# Altium schematic sheet Peripherals.SchDoc
size A
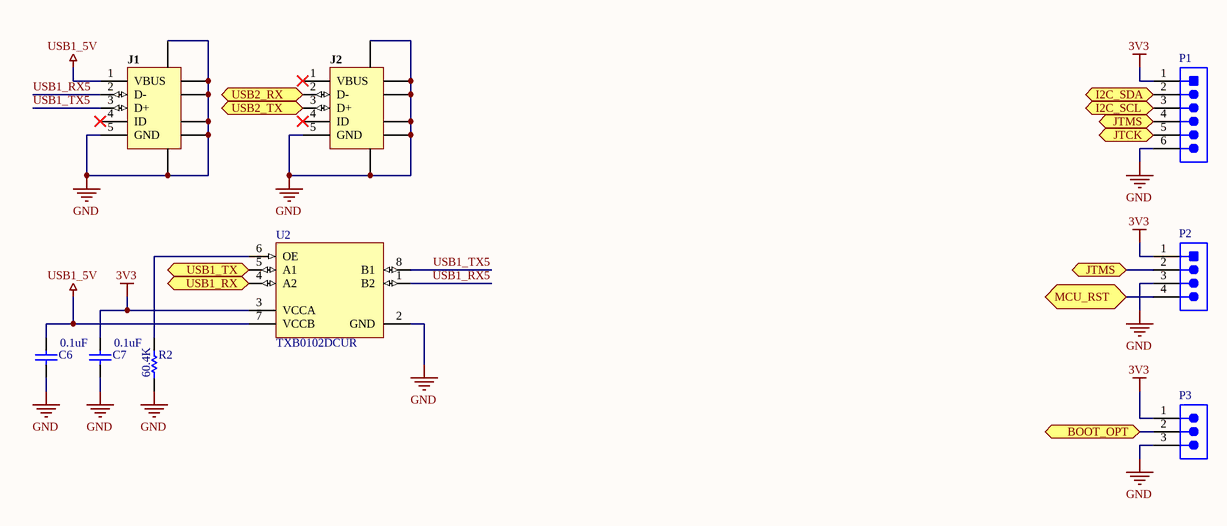
[diagram p0: Peripherals.SchDoc]

## Parts
C6  value 0.1uF  [CAPC3216X100X50LL20T25]  (hidden comment: C1206F104K3RACTU)
C7  value 0.1uF  [CAPC3216X100X50LL20T25]  (hidden comment: C1206F104K3RACTU)
J1  ZX62R-B-5P  [HIRO-ZX62R-B-5P_V]  (value not drawn)
J2  ZX62R-B-5P  [HIRO-ZX62R-B-5P_V]  (value not drawn)
P1  22-23-2061  [MOLX-22-23-2061_V]  (value not drawn)
P2  22-23-2041  [22-23-2041]  (value not drawn)
P3  PTT-103-01-L-S  [SMTC-PTT-103-01-X-S]  (value not drawn)
R2  value 60.4K  [RESC1206(3216)_M]  (hidden comment: 60K4 1% 1206(3216))
U2  TXB0102DCUR  [DCU0008A_N]

## Ports
BOOT_OPT (bidir), I2C_SCL (bidir), I2C_SDA (bidir), JTCK (bidir), JTMS (bidir), MCU_RST (bidir), USB1_RX (bidir), USB1_TX (bidir), USB2_RX (bidir), USB2_TX (bidir)

## Nets
3V3: C7.1 P1.1 P2.1 P3.1 U2.3(VCCA)
GND: C6.2 C7.2 J1.5(GND) J1.6(SHLD) J1.7(SHLD) J1.8(SHLD) J1.9(SHLD) J1.10(SHLD) J1.11(SHLD) J2.5(GND) J2.6(SHLD) J2.7(SHLD) J2.8(SHLD) J2.9(SHLD) J2.10(SHLD) J2.11(SHLD) P1.6 P2.3 P3.3 R2.1 U2.2(GND)
USB1_5V: C6.1 J1.1(VBUS) U2.7(VCCB)
BOOT_OPT: P3.2 ; port BOOT_OPT
I2C_SCL: P1.3 ; port I2C_SCL
I2C_SDA: P1.2 ; port I2C_SDA
JTCK: P1.5 ; port JTCK
JTMS: P1.4 P2.2 ; port JTMS
MCU_RST: P2.4 ; port MCU_RST
USB1_RX: U2.4(A2) ; port USB1_RX
USB1_RX5: J1.2(D-) U2.1(B2)
USB1_TX: U2.5(A1) ; port USB1_TX
USB1_TX5: J1.3(D+) U2.8(B1)
USB2_RX: J2.2(D-) ; port USB2_RX
USB2_TX: J2.3(D+) ; port USB2_TX
NetR2_2: R2.2 U2.6(OE)

Not connected (* = marked no-connect by the designer): J1 4(ID)*; J2 1(VBUS)* 4(ID)*

## Library data of the parts
C6 C7 = CMP-1664-00001-1: CAP CER 0.1UF 25V 10% X7R 1206; PackageReference: 1206; PartNumber: C1206F104K3RACTU; ComponentLink1URL: http://www.kemet.com/docfinder?Partnumber=C1206F104K3RACTU; ComponentLink1Description: Datasheet
J1 J2 = CMP-0031-00001-1: Connector; USBMicro-B,Reverse type, SMT; 5 Position; Right Angle; DatasheetVersion: 08/2010; Operating Temperature: -30 to 85 degC; Mounting Technology: Surface Mount; PartNumber: ZX62R-B-5P; PackageReference: ZX62R-B-5P; ComponentLink2URL: http://www.hirose.co.jp/cataloge_hp/e24200011.pdf; ComponentLink1URL: http://www.hirose.com/â€Ž; ComponentLink2Description: Datasheet; PackageDescription: 5-Pin USB Micro-B R/A Connector; ComponentLink1Description: Manufacturer URL
P1 = CMP-2000-05536-1: Male Header, Pitch 2.54 mm, 1 x 6 Position, Height 10.67 mm, Tail Length 3.56 mm, 0 to 70 degC, RoHS, Bulk; Manufacturer: Molex; Pitch: 2.54mm; Mounting Angle: Vertical; Current Rating: 4A; Number of Positions / Contacts: 6; Voltage Rating: 250V; Packaging: Bulk; Package Description: Male Header, Pitch 2.54 mm, 1 x 6 Position, Height 10.67 mm, Tail Length 3.56 mm; Number of Rows: 1; Type: PinStrip; Contact Material: Brass; Product Category: .100K.K.Connectors; Factory Pack Quantity: 1000; Mounting Style: ThroughHole; RoHS: Details; Contact Plating: Tin; Housing Material: Nylon; Mounting Technology: ThroughHole; Termination Style: ThroughHole; Tradename: KK; Number of Positions: 6; Brand: Molex; Product Type: Headers; Series: 6373; Datasheet URL: https://datasheet.ciiva.com/19460/232303-19460895.pdf; Package Reference: 22-23-2061; Datasheet Version: Rev. P, 09/2001; Manufacturer URL: http://www.molex.com/
P2 = 22-23-2041: MOLEX 4POS MALE HEADER VERT
P3 = CMP-1029-00143-1: Press Fit Header, Through-hole, Vertical, -55 to 125 degC, 2 mm Pitch, 3-Pin, Male, RoHS; Manufacturer: Samtec; Pitch: 2 mm; ComponentLink1Description: Manufacturer URL; ComponentLink3URL: http://www.samtec.com/documents/webfiles/cpdf/PTT-1XX-01-X-S-XXX-MKT.pdf; ComponentLink2Description: Datasheet; ComponentLink1URL: http://www.samtec.com; Temperature Range: -55 to 125 degC; PackageReference: PTT-103-01-X-S; PartNumber: PTT-103-01-L-S; PackageDescription: 2 mm Press Fit Terminal Strip; ComponentLink2URL: http://d2a072wq521u33.cloudfront.net/catalog_english//ptt.pdf; DatasheetVersion: F-214; Mounting Technology: Through-hole; RoHS: True; PackageVersion: C, 1/2011; ComponentLink3Description: Package Specification; Orientation: Vertical
R2 = CMP-1014-00711-1: 60K4 0.25W 1% 1206 (3216 Metric)  SMD; Case-EIA: 1206; Case-Metric: 3216; Technology: SMT; Tolerance: 1 %; Power: 0.25 W
U2 = CMP-0859-00594-3: 2-Bit Bidirectional Voltage-Level Translator with Auto Direction Sensing and +/-15-kV ESD Protect, DCU0008A, LARGE T&R; Manufacturer: Texas Instruments; Rating: Catalog; tpd @ Nom Voltage(Max)(ns): 4.9; Output Type: CMOS; Sub-Family: Dual Supply Translator; Bits(#): 2; Logic: True; Input Type: CMOS/TTL; 3-State Output: No; Voltage(Nom)(V): 3.3; VCC(Min)(V): 1.2; ICC @ Nom Voltage(Max)(mA): 0.005; VCC(Max)(V): 5.5; PackageReference: DCU0008A; Operating Temperature Range(C): -40 to 85; DatasheetVersion: SCES641C; Schmitt Trigger: No; Generic Part Number: TXB0102